# EAGLE design ScouseTom_New (EAGLE 7.2.0)
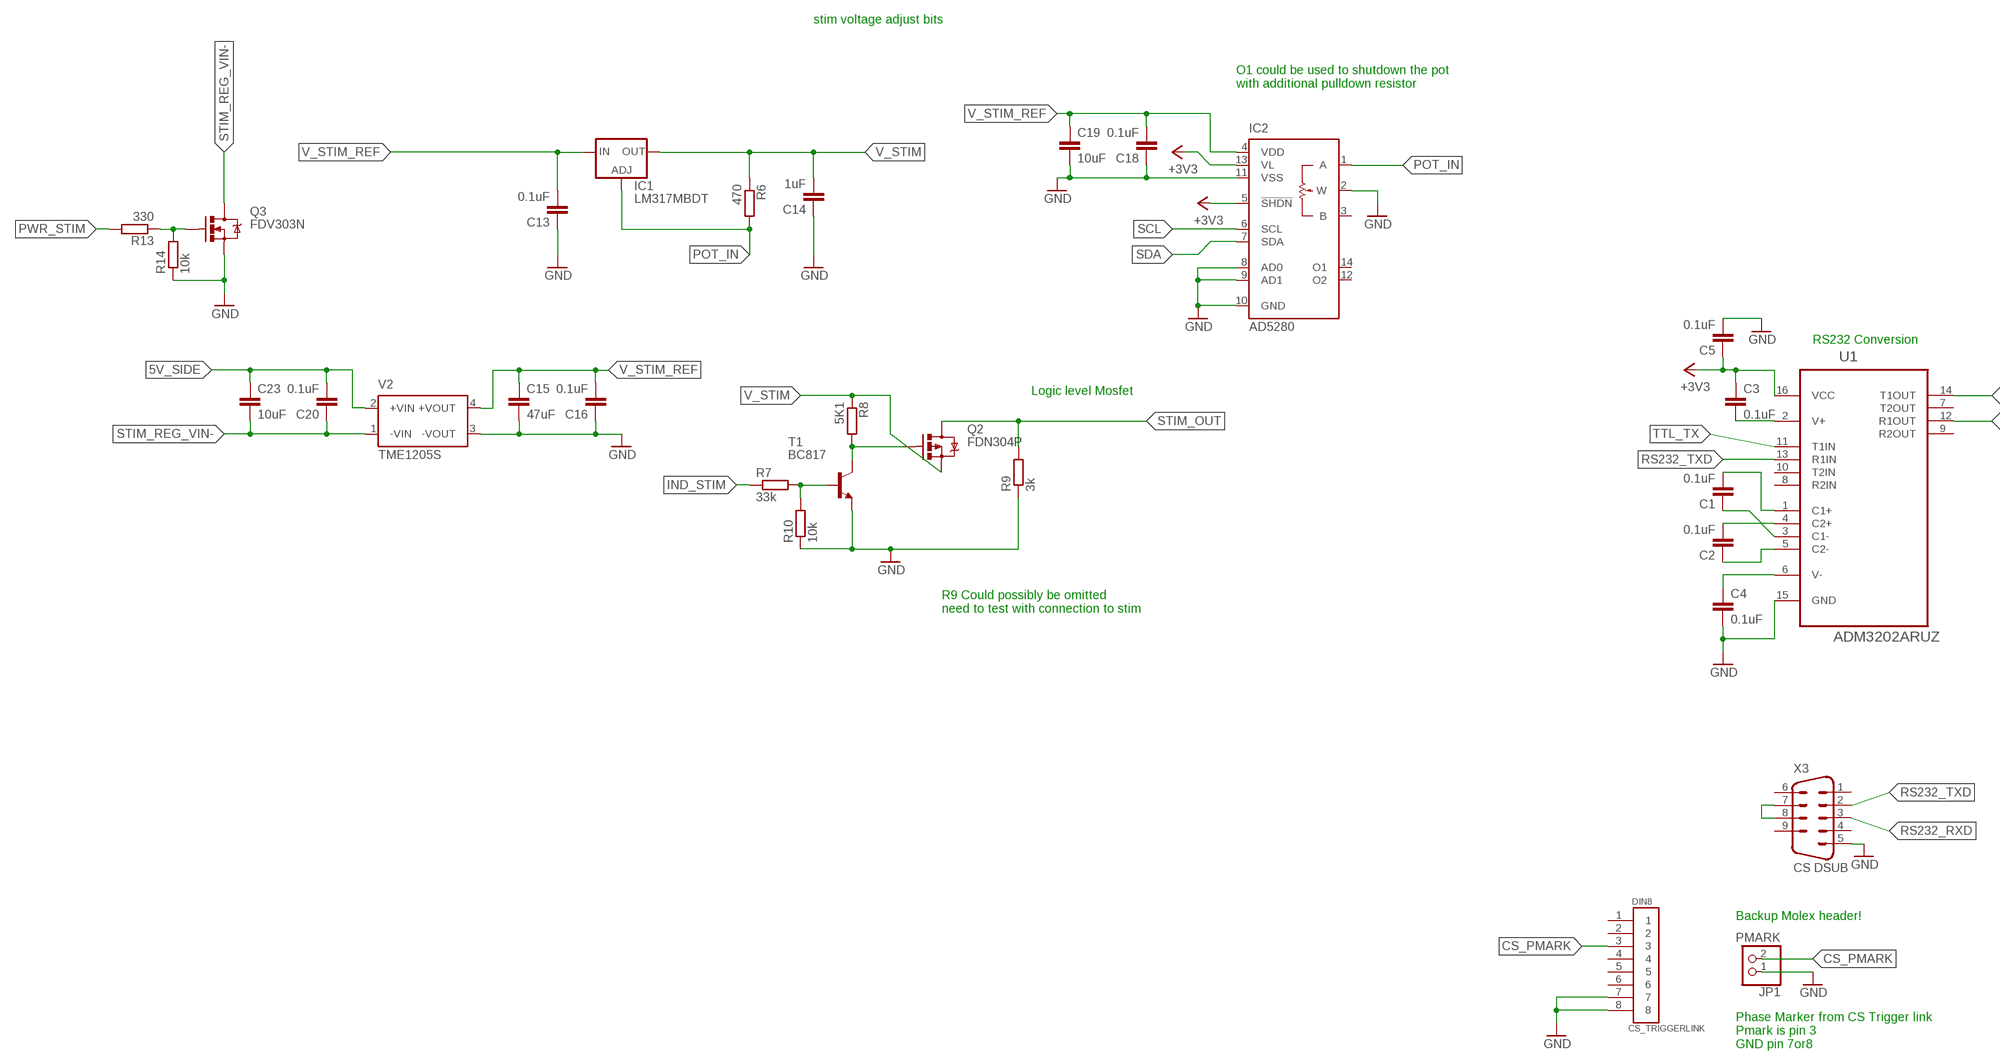
[diagram p0: schematic, sheet 1, part 1 of 2]
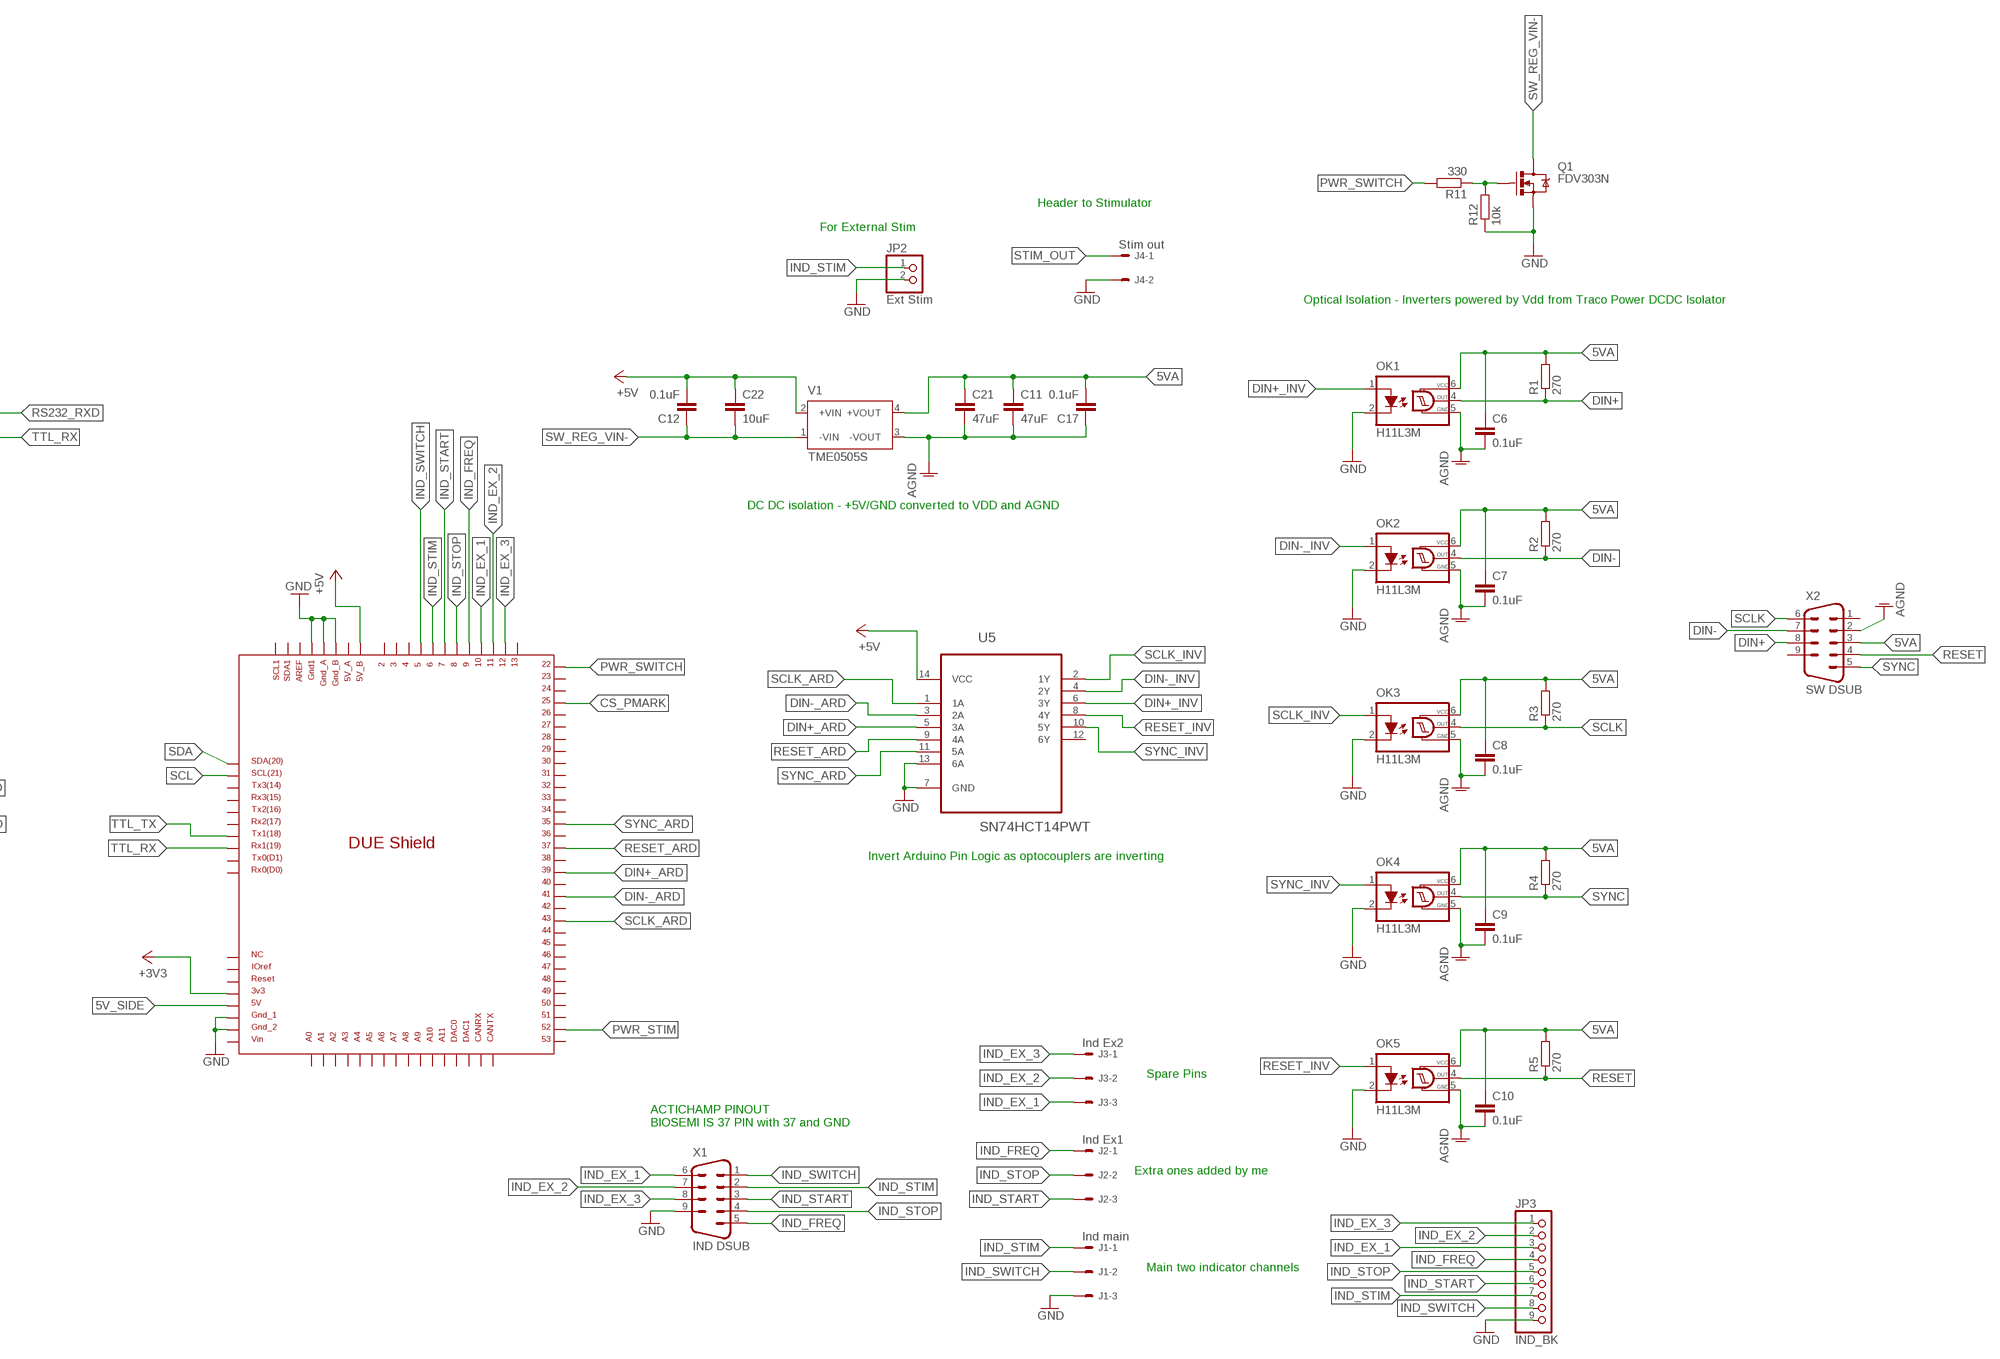
[diagram p1: schematic, sheet 1, part 2 of 2]

## Parts
C1  0.1uF  C-EUC0805  [C0805]
C2  0.1uF  C-EUC0805  [C0805]
C3  0.1uF  C-EUC0805  [C0805]
C4  0.1uF  C-EUC0805  [C0805]
C5  0.1uF  C-EUC0805  [C0805]
C6  0.1uF  C-EUC0805  [C0805]
C7  0.1uF  C-EUC0805  [C0805]
C8  0.1uF  C-EUC0805  [C0805]
C9  0.1uF  C-EUC0805  [C0805]
C10  0.1uF  C-EUC0805  [C0805]
C11  47uF  C-EUC0805  [C0805]
C12  0.1uF  C-EUC0805  [C0805]
C13  0.1uF  C-EUC0805  [C0805]
C14  1uF  C-EUC0805  [C0805]
C15  47uF  C-EUC0805  [C0805]
C16  0.1uF  C-EUC0805  [C0805]
C17  0.1uF  C-EUC0805  [C0805]
C18  0.1uF  C-EUC0805  [C0805]
C19  10uF  C-EUC0805  [C0805]
C20  0.1uF  C-EUC0805  [C0805]
C21  47uF  C-EUC0805  [C0805]
C22  10uF  C-EUC0805  [C0805]
C23  10uF  C-EUC0805  [C0805]
DIN8  CS_TRIGGERLINK  DIN8  [DIN8]
DUE  DUE(NOMID)  [DUE(NOMID)]
IC1  LM317MBDT  [DPACK]
IC2  AD5280  [TSSOP14]
J1  Ind main  22-27-2031-03  [6410-03]
J2  Ind Ex1  22-27-2031-03  [6410-03]
J3  Ind Ex2  22-27-2031-03  [6410-03]
J4  Stim out  22-27-2021-02  [6410-02]
JP1  PMARK  PINHD-1X2  [1X02]
JP2  Ext Stim  PINHD-1X2  [1X02]
JP3  IND_BK  PINHD-1X9  [1X09]
OK1  H11L3M  [DIL06]
OK2  H11L3M  [DIL06]
OK3  H11L3M  [DIL06]
OK4  H11L3M  [DIL06]
OK5  H11L3M  [DIL06]
Q1  FDV303N  MOSFET-NCHANNEL2N7002PW  [SOT323]
Q2  FDN304P  MOSFET-PCHANNEL  [SOT23-3]
Q3  FDV303N  MOSFET-NCHANNEL2N7002PW  [SOT323]
R1  270  R-EU_R0805  [R0805]
R2  270  R-EU_R0805  [R0805]
R3  270  R-EU_R0805  [R0805]
R4  270  R-EU_M0805  [M0805]
R5  270  R-EU_M0805  [M0805]
R6  470  R-EU_R0805  [R0805]
R7  33k  R-EU_R0805  [R0805]
R8  5K1  R-EU_R0805  [R0805]
R9  3k  R-EU_R0805  [R0805]
R10  10k  R-EU_R0805  [R0805]
R11  330  R-EU_R0805  [R0805]
R12  10k  R-EU_R0805  [R0805]
R13  330  R-EU_R0805  [R0805]
R14  10k  R-EU_R0805  [R0805]
T1  BC817  BC817-40SMD  [SOT23-BEC]
U1  ADM3202ARUZ  [SOP65P640X120-16N]
U5  SN74HCT14PWT  [SOP65P640X120-14N]
V1  TME0505S  [TME]
V2  TME1205S  [TME]
X1  IND DSUB  DSUB9RA  [DSUB9]
X2  SW DSUB  DSUB9RA  [DSUB9]
X3  CS DSUB  DSUB9RA  [DSUB9]

## Nets
5V_SIDE: C20.2 C23.1 DUE.5V V2.2(+VIN)
5VA: C6.1 C7.1 C8.1 C9.1 C10.1 C11.1 C17.2 C21.1 OK1.6(VCC) OK2.6(VCC) OK3.6(VCC) OK4.6(VCC) OK5.6(VCC) R1.2 R2.2 R3.2 R4.2 R5.2 V1.4(+VOUT) X2.3
+3V3: C3.1 C5.1 DUE.3V3 IC2.5(!SHDN) IC2.13(VL) U1.16(VCC)
+5V: C12.2 C22.1 DUE.5V_B U5.14(VCC) V1.2(+VIN)
AGND: C6.2 C7.2 C8.2 C9.2 C10.2 C11.2 C17.1 C21.2 OK1.5(GND) OK2.5(GND) OK3.5(GND) OK4.5(GND) OK5.5(GND) V1.3(-VOUT) X2.2
CS_PMARK: DIN8.3 DUE.25 JP1.2
DIN+: OK1.4(OUT) R1.1 X2.8
DIN+_ARD: DUE.39 U5.5(3A)
DIN+_INV: OK1.1(A) U5.6(3Y)
DIN-: OK2.4(OUT) R2.1 X2.7
DIN-_ARD: DUE.41 U5.3(2A)
DIN-_INV: OK2.1(A) U5.4(2Y)
GND: C4.2 C5.2 C13.1 C14.1 C15.2 C16.1 C18.1 C19.2 DIN8.7 DIN8.8 DUE.GND1 DUE.GND_1 DUE.GND_2 DUE.GND_A DUE.GND_B IC2.2(W) IC2.8(AD0) IC2.9(AD1) IC2.10(GND) IC2.11(VSS) J1.3 J4.2 JP1.1 JP2.2 JP3.9 OK1.2(C) OK2.2(C) OK3.2(C) OK4.2(C) OK5.2(C) Q1.2(S) Q3.2(S) R9.1 R10.1 R12.1 R14.1 T1.E U1.15(GND) U5.7(GND) U5.13(6A) V2.3(-VOUT) X1.9 X3.5
IND_EX_1: DUE.10 J3.3 JP3.3 X1.6
IND_EX_2: DUE.11 J3.2 JP3.2 X1.7
IND_EX_3: DUE.12 J3.1 JP3.1 X1.8
IND_FREQ: DUE.9 J2.1 JP3.4 X1.5
IND_START: DUE.7 J2.3 JP3.6 X1.3
IND_STIM: DUE.6 J1.1 JP2.1 JP3.7 R7.1 X1.2
IND_STOP: DUE.8 J2.2 JP3.5 X1.4
IND_SWITCH: DUE.5 J1.2 JP3.8 X1.1
N$1: R7.2 R10.2 T1.B
N$2: Q1.1(G) R11.1 R12.2
N$3: Q2.1(G) R8.2 T1.C
N$4: X3.7 X3.8
N$5: Q3.1(G) R13.1 R14.2
N$22: C1.2 U1.1(C1+)
N$23: C1.1 U1.3(C1-)
N$24: C2.2 U1.4(C2+)
N$25: C2.1 U1.5(C2-)
N$26: C3.2 U1.2(V+)
N$27: C4.1 U1.6(V-)
POT_IN: IC1.1(ADJ) IC2.1(A) R6.2
PWR_STIM: DUE.52 R13.2
PWR_SWITCH: DUE.22 R11.2
RESET: OK5.4(OUT) R5.1 X2.4
RESET_ARD: DUE.37 U5.9(4A)
RESET_INV: OK5.1(A) U5.8(4Y)
RS232_RXD: U1.14(T1OUT) X3.3
RS232_TXD: U1.13(R1IN) X3.2
SCL: DUE.SCL IC2.6(SCL)
SCLK: OK3.4(OUT) R3.1 X2.6
SCLK_ARD: DUE.43 U5.1(1A)
SCLK_INV: OK3.1(A) U5.2(1Y)
SDA: DUE.SDA IC2.7(SDA)
STIM_OUT: J4.1 Q2.3(D) R9.2
STIM_REG_VIN-: C20.1 C23.2 Q3.3(D) V2.1(-VIN)
SW_REG_VIN-: C12.1 C22.2 Q1.3(D) V1.1(-VIN)
SYNC: OK4.4(OUT) R4.1 X2.5
SYNC_ARD: DUE.35 U5.11(5A)
SYNC_INV: OK4.1(A) U5.10(5Y)
TTL_RX: DUE.RX1 U1.12(R1OUT)
TTL_TX: DUE.TX1 U1.11(T1IN)
V_STIM: C14.2 IC1.4(OUT) Q2.2(S) R6.1 R8.1
V_STIM_REF: C13.2 C15.1 C16.2 C18.2 C19.1 IC1.3(IN) IC2.4(VDD) V2.4(+VOUT)
Unconnected: DIN8.1 DIN8.2 DIN8.4 DIN8.5 DIN8.6 DUE.2 DUE.3 DUE.4 DUE.5V_A DUE.13 DUE.23 DUE.24 DUE.26 DUE.27 DUE.28 DUE.29 DUE.30 DUE.31 DUE.32 DUE.33 DUE.34 DUE.36 DUE.38 DUE.40 DUE.42 DUE.44 DUE.45 DUE.46 DUE.47 DUE.48 DUE.49 DUE.50 DUE.51 DUE.53 DUE.A0 DUE.A1 DUE.A2 DUE.A3 DUE.A4 DUE.A5 DUE.A6 DUE.A7 DUE.A8 DUE.A9 DUE.A10 DUE.A11 DUE.AREF DUE.CANRX DUE.CANTX DUE.DAC0 DUE.DAC1 DUE.IOREF DUE.NC DUE.RESET DUE.RX0 DUE.RX2 DUE.RX3 DUE.SCL1 DUE.SDA1 DUE.TX0 DUE.TX2 DUE.TX3 DUE.VIN IC2.3(B) IC2.12(O2) IC2.14(O1) U1.7(T2OUT) U1.8(R2IN) U1.9(R2OUT) U1.10(T2IN) U5.12(6Y) X2.1 X2.9 X3.1 X3.4 X3.6 X3.9

## Notes on the sheet
- stim voltage adjust bits
- O1 could be used to shutdown the pot
  with additional pulldown resistor
- Header to Stimulator
- For External Stim
- Optical Isolation - Inverters powered by Vdd from Traco Power DCDC Isolator
- RS232 Conversion
- Logic level Mosfet
- DC DC isolation - +5V/GND converted to VDD and AGND
- R9 Could possibly be omitted
  need to test with connection to stim
- Invert Arduino Pin Logic as optocouplers are inverting
- Backup Molex header!
- Phase Marker from CS Trigger link
  Pmark is pin 3
  GND pin 7or8
- Spare Pins
- ACTICHAMP PINOUT
  BIOSEMI IS 37 PIN with 37 and GND
- Extra ones added by me
- Main two indicator channels

## Library data of the parts
C1-C23 = resistor:C-EU: CAPACITOR, European symbol
DIN8 = mini din 8 james:DIN8
DUE = DUElib130425_JAMES:DUE(NOMID)
IC1 = v-reg:LM317?*: 500 mA Adjustable Output Positive Voltage Regulator Source: http://www.onsemi.co.jp .. LM317M-D.PDF
IC2 = analog-devices:AD5280: Single +15 V/±5 V, 256-Position, I2C-Compatible Digital Potentiometer Source: http://www.analog.com/static/imported-files/data_sheets/AD5280_5282.pdf; MF: ALTERA CORPORATION; MPN: AD5280BRUZ20; OC_FARNELL: 1464325; OC_NEWARK: 59K3840
J1-J3 = con-molex:22-?-03: CONNECTOR wire to board 2.54 mm (.1 inch) pitch header; OC_FARNELL: unknown; OC_NEWARK: unknown
J4 = con-molex:22-?-02: CONNECTOR wire to board 2.54 mm (.1 inch) pitch header; OC_FARNELL: unknown; OC_NEWARK: unknown
JP1 JP2 = pinhead:PINHD-1X2: PIN HEADER
JP3 = pinhead:PINHD-1X9: PIN HEADER
OK1-OK5 = optocoupler:H11L*M: 6-Pin DIP Optocoupler Source: http://www.fairchildsemi.com/ds/H1/H11L2-M.pdf; MF: FAIRCHILD SEMICONDUCTOR; MPN: H11L3-M; OC_FARNELL: 1021233; OC_NEWARK: 72K8646
Q1 Q3 = SparkFun-DiscreteSemi:MOSFET-NCHANNEL: Common NMOSFET Parts MFG P/N Store ID Prod ID FDD8780 TRANS-09984 SI7820DN TRANS-11055 FDS6630A IC-08089 2N7002PW TRANS-11151 FQP30N06L COM-10213 TRANS-10060 BSS123LT1G TRANS-08345 BSS138 TRANS-00830 BS170 2N7000; PROD_ID: TRANS-11151
Q2 = SparkFun-DiscreteSemi:MOSFET-PCHANNEL: Generic PMOSFET IRLML2244 - TRANS-11153 (SOT-23 -20V -4.3A) (1.Gate 2.Source 3.Drain) FQP27P06 - COM-10349 <http://www.sparkfun.com/products/10349> (TO-220 -60V -27A) (1.Gate 2.Source 3.Drain); PROD_ID: TRANS-08285
R1-R14 = resistor:R-EU_: RESISTOR, European symbol
T1 = transistor-npn:BC817*: NPN Transistor
U1 = Analog Devices_By_element14_Batch_1:ADM3202ARUZ: Low Power, 3.3 V, RS-232 Line Drivers/Receivers; MPN: ADM3202ARUZ; OC_FARNELL: 9425586; OC_NEWARK: 59K2064; PACKAGE: TSSOP-16; SUPPLIER: Analog Devices
U5 = untitled:SN74HCT14PWT: QUADRUPLE FET BUS SWITCH 2.5-V/3.3-V LOW-VOLTAGE BUS SWITCH WITH 5-V-TOLERANT LEVEL SHIFTER; MPN: SN74HCT14PWT; OC_FARNELL: 1236233; OC_NEWARK: 13M5201; PACKAGE: TSSOP-14; SUPPLIER: Texas Instruments
V1 = traco-electronic:TME?*: DC/DC Converter TME Series 1 Watt Source: www.tracopower.com .. tme.pdf; MPN: TME 0505S; OC_FARNELL: 1007538; OC_NEWARK: 51R5321
V2 = traco-electronic:TME?*: DC/DC Converter TME Series 1 Watt Source: www.tracopower.com .. tme.pdf; MPN: TME 1205S; OC_FARNELL: 1007542; OC_NEWARK: 51R5325
X1-X3 = DSUBJAMES:DSUB9RA

## Net classes
1 power: width 0.61 mm, drill 0.61 mm, clearance 0.254 mm
2 gnd: width 0.305 mm, drill 0.559 mm, clearance 0.254 mm
3 usbvcc: width 0.508 mm, drill 0.61 mm, clearance 0.254 mm
4 aref: width 0.406 mm, drill 0.61 mm, clearance 0.254 mm

## Board
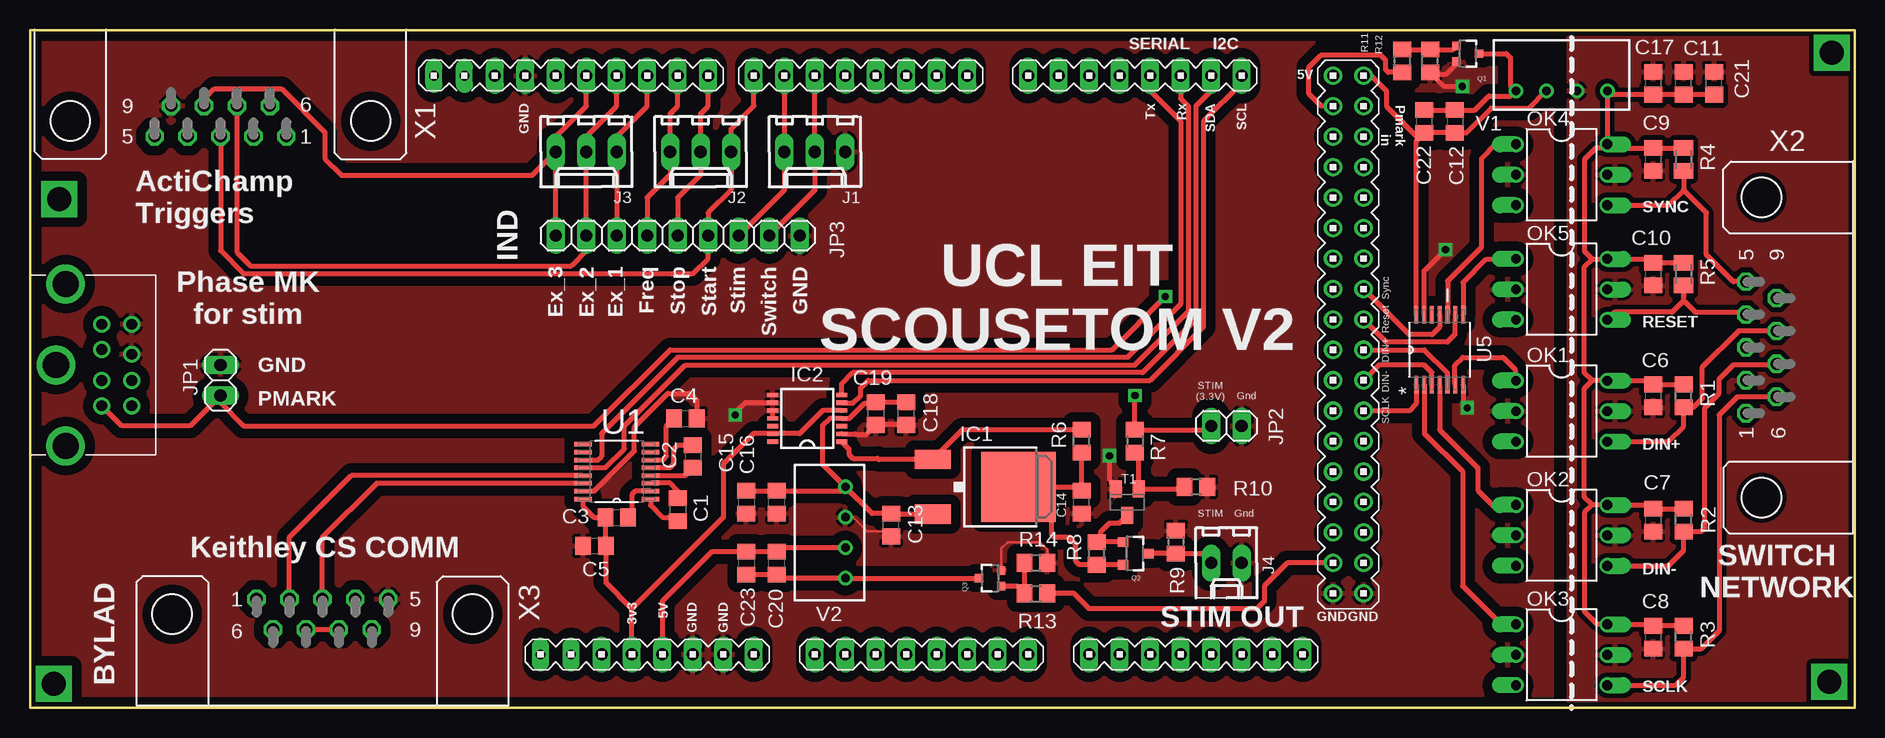
[diagram p2: board, top side]
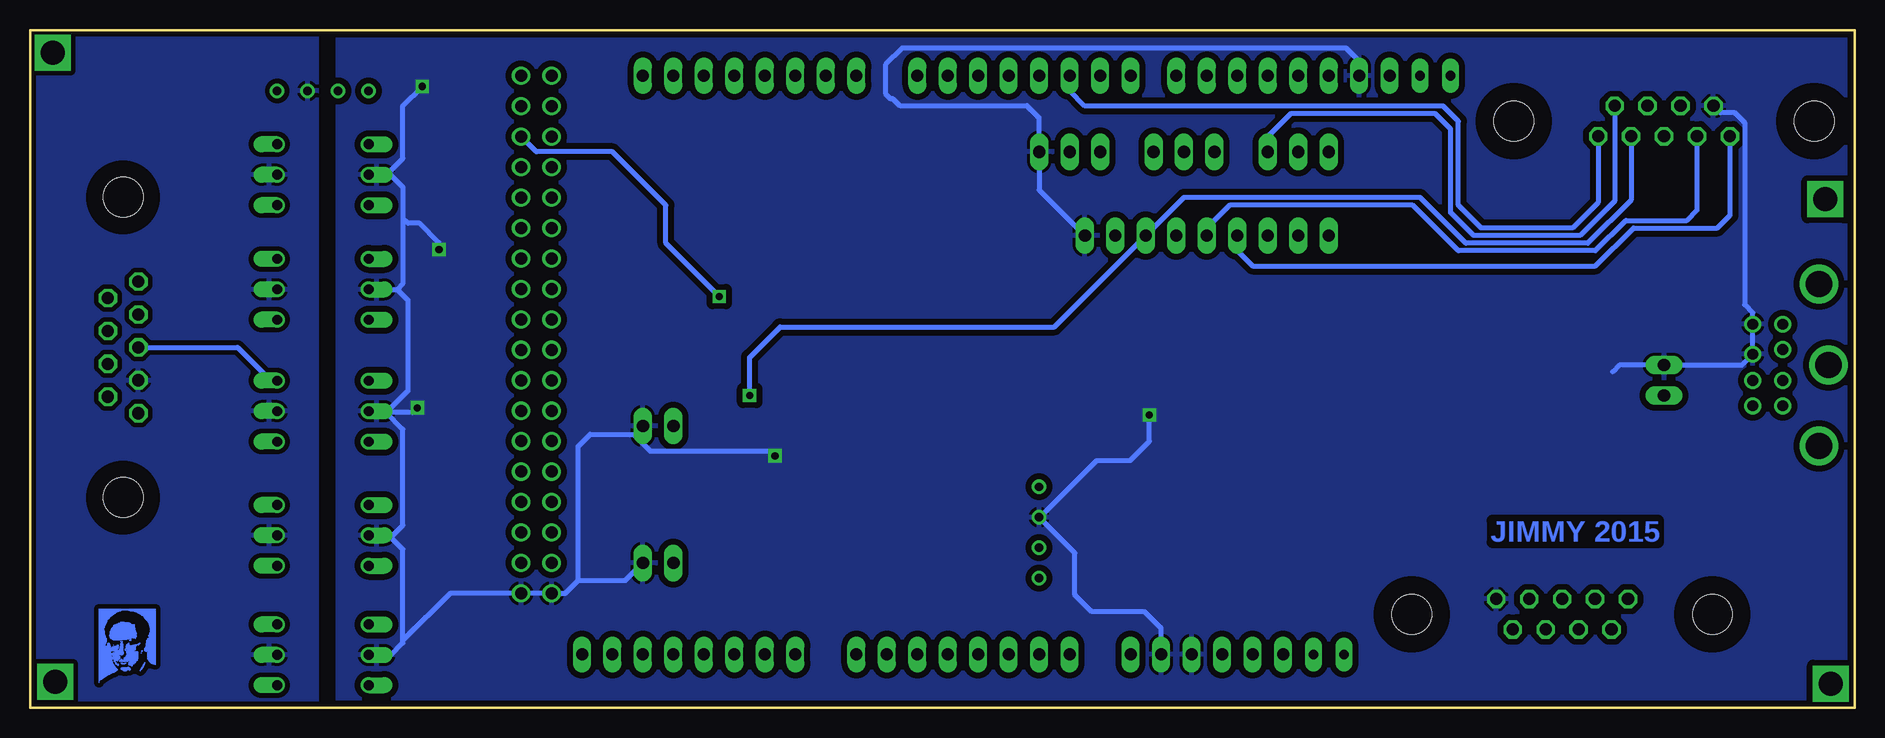
[diagram p3: board, bottom side, seen from below]

Size 152.05 x 56.52 mm. Coordinates in mm from the lower left corner, seen from the top.
Outline: 152.05,56.52 0,56.52 0,0 152.05,0 152.05,56.52
Copper layers (1*16): Top 0.035mm / dielectric 1.5mm / Bottom 0.035mm
Design rules "pcbtrain": minimum track width 0.2mm, minimum drill 0.4mm, track to track 0.2mm, track to pad 0.2mm, pad to pad 0.2mm, via to via 0.2mm, smd to smd 0mil, copper to edge 10mil, drill to drill 0.2mm, minimum pad ring 10mil, minimum via ring 10mil, stop-mask expansion 0.125mm, vias tented up to drill 0mil, thermal gap 10mil

### Footprints (pad centres in the part's own frame; a part is rotated, then mirrored left to right if it is on the bottom)
C0805 = smd 1.3 x 1.5: 1 -0.95,0; 2 0.95,0
DIN8 = drill 0.9: 1 -1.3,-3.8; 2 1.3,-3.8; 3 -3.4,-3.8; 4 -1.3,-6.3; 5 3.4,-3.8; 6 -3.4,-6.3; 7 0.9,-6.3; 8 3.4,-6.3 | drill 2.2: P$1 0,0; P$2 -6.75,-0.8; P$3 6.75,-0.8
DUE(NOMID) = drill 1 long: 2 -5.08,25.4; 3 -7.62,25.4; 3V3 -27.94,-22.86; 4 -10.16,25.4; 5 -12.7,25.4; 5V -25.4,-22.86; 6 -15.24,25.4; 7 -17.78,25.4; 8 -21.59,25.4; 9 -24.13,25.4; 10 -26.67,25.4; 11 -29.21,25.4; 12 -31.75,25.4; 13 -34.29,25.4; A0 -12.7,-22.86; A1 -10.16,-22.86; A2 -7.62,-22.86; A3 -5.08,-22.86; A4 -2.54,-22.86; A5 0,-22.86; A6 2.54,-22.86; A7 5.08,-22.86; A8 10.16,-22.86; A9 12.7,-22.86; A10 15.24,-22.86; A11 17.78,-22.86; AREF -39.37,25.4; CANRX 25.4,-22.86; CANTX 27.94,-22.86; DAC0 20.32,-22.86; DAC1 22.86,-22.86; GND1 -36.83,25.4; GND_1 -22.86,-22.86; GND_2 -20.32,-22.86; RESET -30.48,-22.86; RX0 0,25.4; RX1 17.78,25.4; RX2 12.7,25.4; RX3 7.62,25.4; SCL 22.86,25.4; SDA 20.32,25.4; TX0 -2.54,25.4; TX1 15.24,25.4; TX2 10.16,25.4; TX3 5.08,25.4; VIN -17.78,-22.86 | drill 1: 5V_A 30.48,25.4; 5V_B 33.02,25.4; 22 30.48,22.86; 23 33.02,22.86; 24 30.48,20.32; 25 33.02,20.32; 26 30.48,17.78; 27 33.02,17.78; 28 30.48,15.24; 29 33.02,15.24; 30 30.48,12.7; 31 33.02,12.7; 32 30.48,10.16; 33 33.02,10.16; 34 30.48,7.62; 35 33.02,7.62; 36 30.48,5.08; 37 33.02,5.08; 38 30.48,2.54; 39 33.02,2.54; 40 30.48,0; 41 33.02,0; 42 30.48,-2.54; 43 33.02,-2.54; 44 30.48,-5.08; 45 33.02,-5.08; 46 30.48,-7.62; 47 33.02,-7.62; 48 30.48,-10.16; 49 33.02,-10.16; 50 30.48,-12.7; 51 33.02,-12.7; 52 30.48,-15.24; 53 33.02,-15.24; GND_A 30.48,-17.78; GND_B 33.02,-17.78 | drill 0.8 pad 1.422 long: IOREF -33.02,-22.86; NC -35.56,-22.86; SCL1 -44.45,25.4; SDA1 -41.91,25.4
DPACK = smd 1.6 x 3: 1 -2.28,-4.8; 3 2.28,-4.8 | smd 5.8 x 6.2: 4 0,2.38
TSSOP14 = smd 0.9 x 0.35: 1 -2.875,1.95; 2 -2.875,1.3; 3 -2.875,0.65; 4 -2.875,0; 5 -2.875,-0.65; 6 -2.875,-1.3; 7 -2.875,-1.95; 8 2.875,-1.95; 9 2.875,-1.3; 10 2.875,-0.65; 11 2.875,0; 12 2.875,0.65; 13 2.875,1.3; 14 2.875,1.95
6410-03 = drill 1.016 long: 1 2.54,0; 2 0,0; 3 -2.54,0
6410-02 = drill 1.016 long: 1 1.27,0; 2 -1.27,0
1X02 = drill 1.016 long: 1 -1.27,0; 2 1.27,0
1X09 = drill 1.016 long: 1 -10.16,0; 2 -7.62,0; 3 -5.08,0; 4 -2.54,0; 5 0,0; 6 2.54,0; 7 5.08,0; 8 7.62,0; 9 10.16,0
DIL06 = drill 0.813 offset: 1 -2.54,-3.81; 2 0,-3.81; 3 2.54,-3.81; 4 2.54,3.81; 5 0,3.81; 6 -2.54,3.81
SOT323 = smd 0.7 x 0.7: 1 -0.65,-0.925; 2 0.65,-0.925; 3 0,0.925
SOT23-3 = smd 0.8 x 0.9: 1 -0.95,-1; 2 0.95,-1; 3 0,1.1
R0805 = smd 1.3 x 1.5: 1 -0.95,0; 2 0.95,0
M0805 = smd 1.3 x 1.6: 1 -0.95,0; 2 0.95,0
SOT23-BEC = smd 1 x 1.4: B -0.95,-1.1; C 0,1.1; E 0.95,-1.1
SOP65P640X120-16N = smd 1.473 x 0.356: 1 -2.819,2.286; 2 -2.819,1.626; 3 -2.819,0.965; 4 -2.819,0.33; 5 -2.819,-0.33; 6 -2.819,-0.965; 7 -2.819,-1.626; 8 -2.819,-2.286; 9 2.819,-2.286; 10 2.819,-1.626; 11 2.819,-0.965; 12 2.819,-0.33; 13 2.819,0.33; 14 2.819,0.965; 15 2.819,1.626; 16 2.819,2.286
SOP65P640X120-14N = smd 1.473 x 0.356: 1 -2.921,1.956; 2 -2.921,1.295; 3 -2.921,0.66; 4 -2.921,0; 5 -2.921,-0.66; 6 -2.921,-1.295; 7 -2.921,-1.956; 8 2.921,-1.956; 9 2.921,-1.295; 10 2.921,-0.66; 11 2.921,0; 12 2.921,0.66; 13 2.921,1.295; 14 2.921,1.956
TME = drill 0.7 pad 1.1: 1 -3.81,0; 2 -1.27,0; 3 1.27,0; 4 3.81,0
DSUB9 = drill 1.016 octagon: 1 -5.486,0; 2 -2.743,0; 3 0,0; 4 2.743,0; 5 5.486,0; 6 -4.115,-2.54; 7 -1.372,-2.54; 8 1.372,-2.54; 9 4.115,-2.54 | hole 3.302: 12.522,-1.27; -12.522,-1.27

### Placement (x,y rotation side)
C1  53.98,16.51 270 top
C2  55.25,20.95 270 top
C3  48.89,15.88 0 top
C4  54.61,24.13 0 top
C5  47.03,13.47 180 top
C6  135.25,26 270 top
C7  135.25,15.64 270 top
C8  135.25,5.88 270 top
C9  135.25,45.72 270 top
C10  135.25,36.16 270 top
C11  137.8,52.07 90 top
C12  118.75,48.89 270 top
C13  71.75,15.24 90 top
C14  87.63,17.15 90 top
C15  59.69,17.15 270 top
C16  62.23,17.15 90 top
C17  135.25,52.07 270 top
C18  73.03,24.53 90 top
C19  70.48,24.53 270 top
C20  62.23,12.06 90 top
C21  140.33,52.07 90 top
C22  116.2,48.89 90 top
C23  59.69,12.06 270 top
DIN8  2.18,28.57 90 top
DUE  78.11,27.3 0 top
IC1  80.01,18.41 270 top
IC2  64.77,24.13 180 top
J1  65.41,46.35 180 top
J2  55.88,46.35 180 top
J3  46.36,46.35 180 top
J4  99.7,12.06 180 top
JP1  15.88,27.3 270 top
JP2  99.7,23.49 0 top
JP3  53.98,39.37 0 top
OK1  127.64,24.73 270 top
OK2  127.64,14.37 270 top
OK3  127.64,4.41 270 top
OK4  127.64,44.45 270 top
OK5  127.64,34.89 270 top
Q1  119.81,54.54 270 top
Q2  92.08,12.87 270 top
Q3  80.01,10.79 90 top
R1  137.8,26 90 top
R2  137.8,15.64 90 top
R3  137.8,5.88 90 top
R4  137.8,45.72 90 top
R5  137.8,36.16 90 top
R6  87.63,22.23 90 top
R7  92.08,22.23 270 top
R8  88.9,12.87 90 top
R9  95.48,13.81 270 top
R10  97.16,18.41 180 top
R11  114.33,53.94 270 top
R12  116.67,53.94 90 top
R13  83.82,9.53 0 top
R14  83.82,12.06 180 top
T1  91.44,17.15 180 top
U1  48.89,19.69 180 top
U5  117.47,29.84 90 top
V1  127.64,51.43 0 top
V2  67.94,14.6 90 top
X1  15.88,47.65 180 top
X2  143.01,30.05 90 top
X3  24.37,9.06 0 top

### Tracks (layer width: path | path; a pad name or v marks a point on that pad's centre or on a via)
5V_SIDE
  Top 0.406: DUE.5V 52.7,8.89 56.83,13.01 C23.1 C20.2 62.55,13.33 V2.2
5VA
  Top 0.406: C21.1 C11.1 C17.2 133.03,51.12 131.76,51.12 V1.4 OK4.6 131.76,46.67 | 131.76,46.67 C9.1 R4.2 | R5.2 C10.1 134.94,37.43 OK5.6 130.18,37.43 | 131.76,46.67 130.49,46.67 129.54,45.72 129.54,38.06 130.18,37.43 | 130.18,27.27 OK1.6 134.94,27.27 C6.1 R1.2 | 130.18,27.27 129.54,27.91 129.54,36.8 130.18,37.43 | 130.18,16.91 129.54,17.55 129.54,26.63 130.18,27.27 | 130.18,16.91 OK2.6 134.94,16.91 C7.1 R2.2 | 130.18,16.91 129.54,16.27 129.54,8.03 130.56,7.01 131.39,7.01 OK3.6 135.13,6.95 C8.1 R3.2
  Bottom 0.406: X2.3 134.74,30.05 131.97,27.27 OK1.6
+3V3
  Top 0.406: IC2.5 66.06,24.78 64.13,22.86 61.92,22.86 | 61.92,22.86 IC2.13 | U1.16 46.08,16.79 46.99,15.88 C3.1 47.95,13.51 C5.1 47.98,10.44 50.16,8.26 | 61.92,22.86 60.33,22.86 57.79,20.32 57.79,15.88 50.16,8.26 | DUE.3V3 50.16,8.26
+5V
  Top 0.406: U5.14 115.52,47.26 115.73,47.47 | 115.73,47.47 C22.1 C12.2 119.7,47.95 121.77,50 124.94,50 V1.2 | DUE.5V_B 111.76,52.7 113.03,51.43 113.03,50.16 115.73,47.47
AGND
  pour Top (isolate 0.406): 128.27,56.52 152.05,56.52 152.05,0 128.27,0
  pour Bottom (isolate 0.4): 128.17,56.41 151.97,56.41 151.97,0.01 128.17,0.01
CS_PMARK  (via drill 0.6)
  Top 0.406: v94.61,34.29 90.17,29.84 53.34,29.84 46.99,23.49 17.78,23.49 15.88,25.4 JP1.2 13.34,23.49 7.66,23.49 DIN8.3
  Bottom 0.406: v94.61,34.29 99.06,38.73 99.06,41.91 103.5,46.35 109.86,46.35 DUE.25
DIN+
  Top 0.406: OK1.4 136.53,22.19 137.8,23.46 R1.1 138.61,25.05 139.37,25.8 139.37,28.41 142.38,31.42 X2.8
DIN+_ARD
  Top 0.406: DUE.39 116.2,29.84 118.11,27.94 118.11,26.95 U5.5
DIN+_INV
  Top 0.406: U5.6 118.75,26.95 118.75,28.57 119.38,29.21 122.76,29.21 123.77,28.2 123.77,27.33 OK1.1
DIN-
  Top 0.406: OK2.4 136.53,11.83 137.8,13.1 R2.1 139.25,14.69 139.56,15.01 139.56,25 140.76,26.2 140.76,27.41 141.97,28.6 145.49,28.6 X2.7
DIN-_ARD
  Top 0.406: U5.3 116.81,27.96 116.2,28.57 112.39,28.57 DUE.41
DIN-_INV
  Top 0.406: U5.4 117.47,23.18 120.65,20 120.65,18.12 121.97,16.8 123.72,16.8 OK2.1
GND  (via drill 0.6)
  Top 0.2: V2.3 68.59,15.88 69.77,14.71 71.34,14.71 C13.1 | Q3.2 80.94,13.28 81.47,13.81 84.16,13.81 84.77,13.21 R14.1
  Top 0.406: IC2.2 68.74,22.83 68.77,22.8 69.71,22.8 C19.2 70.51,23.6 72.97,23.6 72.99,23.58 C18.1 | U5.13 116.18,36.42 v117.97,38.2 | v119.36,51.8 117.86,51.8 R12.1 116.86,52.8 117.97,52.8 118.89,53.73 Q1.2 | v58.77,24.41 58.77,24.6 59.59,25.43 IC2.9 | T1.E 90.17,18.57 90.17,18.8 89.97,19.01 v89.97,21.01 | U1.15 47.02,18.06 50.37,21.41 50.37,23.41 53.16,26.2 54.97,26.2 55.56,25.6 C4.2 | U5.7 119.43,25.34 v119.77,25 | IC2.11 IC2.10
  Bottom 0.406: OK3.2 121.96,4.41 120.97,5.4 120.97,5.6 | 120.97,5.6 120.97,13.21 122.13,14.37 OK2.2 121.8,14.37 120.97,15.21 120.97,23.2 122.36,24.6 | 122.36,24.6 123.7,24.6 OK1.2 | OK5.2 121.45,34.89 | 121.45,34.89 120.56,34 120.56,26.41 122.36,24.6 | OK4.2 122.01,44.45 | 122.01,44.45 120.97,43.41 120.97,40.8 | 120.97,40.8 120.97,35.38 121.45,34.89 | 106.36,10.6 107.45,9.53 DUE.GND_A DUE.GND_B 117.05,9.53 120.97,5.6 | 106.36,10.6 106.36,21.8 105.36,22.8 101.66,22.8 | 101.66,22.8 JP2.2 | 106.36,10.6 102.42,10.6 J4.2 | 20.16,28 19.59,28.57 JP1.1 9.38,28.57 DIN8.7 DIN8.8 8.48,32.91 9.17,33.6 9.17,48.8 9.96,49.6 11.18,49.6 X1.9 | DUE.GND1 41.28,53.91 42.37,55 79.37,55 80.77,53.61 80.77,51.2 80.37,50.8 80.16,50.8 79.56,50.2 68.97,50.2 67.97,49.2 67.97,46.38 J1.3 67.94,43.18 JP3.9 | DUE.GND_2 57.79,6.63 59.16,8.01 63.56,8.01 64.97,9.4 64.97,12.9 V2.3 67.9,15.88 63.16,20.6 60.37,20.6 58.77,22.2 v58.77,24.41 | v117.97,38.2 117.97,38.8 119.56,40.41 120.56,40.41 120.97,40.8 | 122.01,44.45 122.01,44.76 120.97,45.8 120.97,50.2 v119.36,51.8 | 101.66,22.8 101.66,22.7 100.36,21.41 90.36,21.41 v89.97,21.01 | v119.77,25 120.17,24.6 122.36,24.6
  pour Top (isolate 0.813): -0.04,56.41 126.77,56.41 126.77,0.01 0.07,0.51
  pour Bottom (isolate 0.5): 0.16,56.41 0.02,0.53 126.36,0.21 126.36,56.41
IND_EX_1
  Top 0.406: DUE.10 51.44,50.16 48.89,47.62 J3.3 JP3.3
  Bottom 0.406: X1.6 19.99,42.24 22.86,39.37 31.75,39.37 33.66,41.27 33.66,48.26 34.92,49.53 46.99,49.53 48.89,47.62 J3.3
IND_EX_2
  Top 0.406: DUE.11 48.89,50.16 46.36,47.62 J3.2 JP3.2 46.36,38.1 45.09,36.83 18.41,36.83 17.25,38 X1.7
IND_EX_3
  Top 0.406: J3.1 43.81,47.62 46.36,50.16 DUE.12 | JP3.1 J3.1 | J3.1 41.87,44.41 25.96,44.41 24.57,45.8 24.57,48 20.96,51.6 15.37,51.6 14.5,50.74 X1.8
IND_FREQ
  Top 0.406: JP3.4 51.44,42.55 53.34,44.45 J2.1 53.34,49.53 53.98,50.16 DUE.9
  Bottom 0.406: JP3.4 51.44,38.1 50.16,36.83 21.59,36.83 18.41,40 11.43,40 10.39,41.05 X1.5
IND_START
  Top 0.406: DUE.7 60.33,50.16 58.42,48.26 J2.3 58.42,43.18 56.52,41.27 JP3.6 56.52,37.46 55.25,36.2 17.78,36.2 15.88,38.1 X1.3
IND_STIM  (via drill 0.6)
  Top 0.406: DUE.6 J1.1 62.87,43.18 JP3.7 | JP2.1 98.11,23.17 R7.1 v92.08,26.03
  Bottom 0.406: X1.2 18.62,42.34 22.23,38.73 32.38,38.73 36.2,42.55 55.88,42.55 JP3.7 66.67,31.75 89.53,31.75 92.08,29.21 v92.08,26.03
IND_STOP
  Top 0.406: DUE.8 56.52,50.16 55.88,49.53 J2.2 55.88,44.45 53.98,42.55 JP3.5
  Bottom 0.406: JP3.5 53.98,40 52.07,41.91 36.83,41.91 33.02,38.1 21.59,38.1 19.05,40.64 13.97,40.64 13.13,41.48 X1.4
IND_SWITCH
  Top 0.406: JP3.8 65.41,43.18 J1.2 DUE.5
  Bottom 0.406: X1.1 21.36,42.14 23.5,40 31.12,40 33.02,41.91 33.02,48.89 34.29,50.16 64.13,50.16 65.41,51.43 DUE.5
N$1
  Top 0.406: R10.2 95.56,18.24 T1.B 92.39,20.96 R7.2
N$2
  Top 0.406: R11.1 R12.2 118.59,54.89 Q1.1
N$3
  Top 0.406: Q2.1 R8.2 88.9,14.13 89.22,14.13 89.22,14.66 89.97,15.4 90.8,15.4 T1.C 91.44,15.56
N$4
  Top 0.406: X3.7 X3.8
N$5
  Top 0.406: Q3.1 82.25,10.15 R13.1 R14.2
N$6  (via drill 2)
  other vias: 149.94,2.16
N$7  (via drill 2)
  other vias: 150.17,54.61
N$8  (via drill 2)
  other vias: 2.42,42.41
N$9  (via drill 2)
  other vias: 1.96,2.01
N$22
  Top 0.406: U1.1 51.71,16.87 52.7,15.88 53.66,15.88 C1.2
N$23
  Top 0.406: C1.1 53.98,18.1 53.34,18.73 51.73,18.73 U1.3
N$24
  Top 0.406: U1.4 54.59,19.35 C2.2
N$25
  Top 0.406: U1.5 53.35,20.02 53.66,20.32 53.66,21.59 53.98,21.91 C2.1
N$26
  Top 0.406: U1.2 50.44,18.06 50.16,17.78 50.16,16.2 C3.2
N$27
  Top 0.406: U1.6 52.72,20.65 53.02,20.95 53.02,23.49 C4.1
POT_IN
  Top 0.406: R6.2 77.69,23.17 IC1.1 70.75,20.7 70.63,20.8 68.56,20.8 68.23,21.13 68.23,21.59 IC2.1
PWR_STIM
  Top 0.406: DUE.52 104.78,12.06 102.87,10.16 102.87,8.89 102.23,8.26 88.27,8.26 87,9.53 R13.2
PWR_SWITCH
  Top 0.406: DUE.22 107.61,50.16 106.56,51.2 106.56,53.41 107.56,54.41 112.56,54.41 112.97,54 112.97,53.2 113.18,52.99 R11.2
RESET
  Top 0.406: 137.8,33.94 R5.1 137.8,34.25 | OK5.4 132.08,32.98 136.84,32.98 137.8,33.94 | 137.8,33.94 137.83,33.94 138.76,33 142.8,33 X2.4
RESET_ARD
  Top 0.406: U5.9 118.77,32.41 118.75,32.38 118.75,31.11 118.11,30.48 113.03,30.48 DUE.37
RESET_INV
  Top 0.406: U5.8 119.43,35.47 121.36,37.41 123.8,37.41 OK5.1
RS232_RXD
  Top 0.406: U1.14 28.88,18.72 24.37,14.21 X3.3
RS232_TXD
  Top 0.406: U1.13 26.77,19.35 21.62,14.21 X3.2
SCL
  Top 0.406: DUE.SCL 100.97,52.07 97.79,48.89 97.79,31.75 93.34,27.3 69.85,27.3 69.22,26.67 69.22,26.03 68.58,25.4 68.55,25.43 IC2.6
SCLK
  Top 0.406: OK3.4 137.12,1.87 137.8,2.54 R3.1 139.29,4.93 140.76,6.4 140.76,24.41 142.29,25.93 X2.6
SCLK_ARD
  Top 0.406: U5.1 115.52,25.35 114.94,24.77 DUE.43
SCLK_INV
  Top 0.406: U5.2 116.2,26.9 116.2,22.86 119.38,19.69 119.38,10.16 119.41,10.16 122.56,7.01 123.77,7.01 OK3.1
SDA
  Top 0.406: DUE.SDA 98.42,51.43 97.16,50.16 97.16,32.38 92.71,27.94 68.58,27.94 67.65,27 IC2.7
STIM_OUT
  Top 0.406: J4.1 97.62,12.87 R9.2 Q2.3
STIM_REG_VIN-
  Top 0.406: Q3.3 V2.1 62.55,10.79 C20.1 C23.2
SW_REG_VIN-
  Top 0.406: C22.2 C12.1 120.41,49.84 121.56,51 123.39,51 V1.1 123.36,51.89 123.36,54.2 123.03,54.54 Q1.3
SYNC
  Top 0.406: OK4.4 136.53,41.91 137.8,43.18 | R4.1 137.8,43.18 | 137.8,43.18 139.7,41.27 139.7,37.78 141.95,35.53 X2.5
SYNC_ARD
  Top 0.406: U5.11 117.47,31.75 116.84,31.11 114.94,31.11 DUE.35
SYNC_INV
  Top 0.406: U5.10 118.14,35.59 120.97,38.41 120.97,45.8 122.17,47 123.81,47 OK4.1
TTL_RX
  Top 0.406: U1.12 47.95,20.02 49.53,21.59 49.53,23.49 54.61,28.57 92.08,28.57 96.52,33.02 96.52,50.16 95.89,50.8 DUE.RX1
TTL_TX
  Top 0.406: U1.11 47.32,20.65 47.62,20.95 47.62,22.86 53.98,29.21 91.44,29.21 95.89,33.66 95.89,48.89 93.34,51.43 DUE.TX1
V_STIM
  Top 0.406: Q2.2 R8.1 87.45,11.92 87.16,12.21 87.16,13.6 86.56,14.21 85.37,14.21 85.16,14.4 85.16,15.64 IC1.4 87.31,18.41 C14.2 R6.1
V_STIM_REF
  Top 0.406: IC1.3 71.81,16.13 C13.2 70.17,16.19 V2.4 | C15.1 C16.2 67.62,18.09 V2.4 | V2.4 66.04,20.32 66.04,23.49 66.67,24.13 IC2.4 68.29,24.13 69.56,25.41 70.41,25.41 C19.1 C18.2
(copper drawn outside any net)
  shapes: Bottom area x1071

### Text on the board
Bottom: JIMMY 2015
tPlace: SERIAL | I2C | 5V | GND | Tx | Rx | SDA | SCL | Pmark / in | ActiChamp / Triggers | SYNC | IND | Ex_3 | Ex_2 | Ex_1 | Freq | Stop | Start | Stim | Switch | GND | Sync | Phase MK / for stim | UCL EIT / SCOUSETOM V2 | Reset | RESET | DIN+ | GND | DIN- | PMARK | STIM / (3.3V) | Gnd | SCLK | DIN+ | STIM | Gnd | Keithley CS COMM | DIN- | SWITCH / NETWORK | 3v3 | 5V | GND | GND | STIM OUT | GND | GND | BYLAD | SCLK